# EAGLE design WiFiShield (EAGLE 6.3)
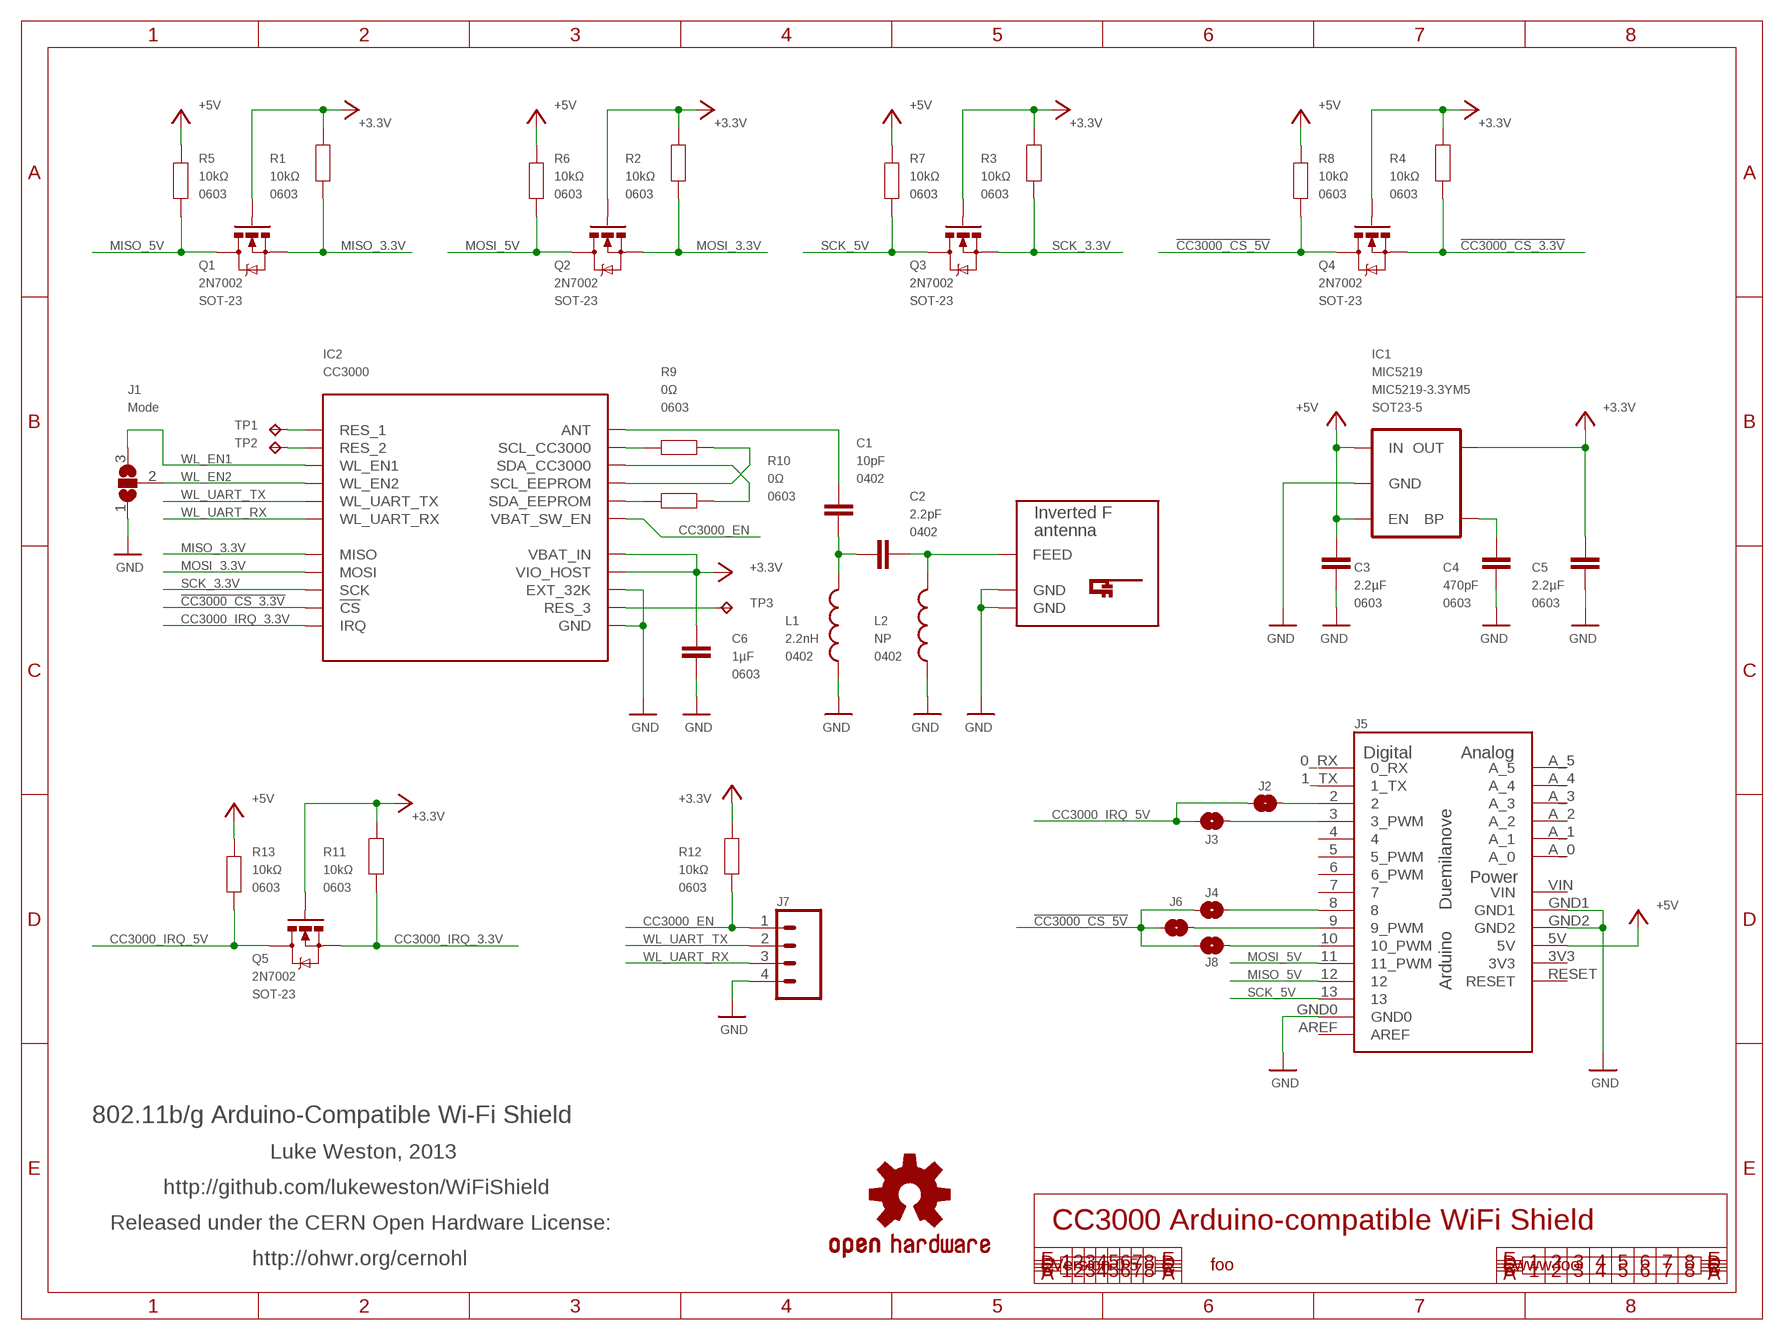
[diagram p0: schematic, sheet 1]

## Parts
A1  INVERTED_F_ANTENNA+2  [DN007+2]
C1  10pF  CAP0402  [C0402]
C2  2.2pF  CAP0402  [C0402]
C3  2.2µF  CAP0603  [0603]
C4  470pF  CAP0603  [0603]
C5  2.2µF  CAP0603  [0603]
C6  1µF  CAP0603  [0603]
IC1  MIC5219  V_REG_LDOSMD  [SOT23-5]
IC2  CC3000  [CC3000]
J1  Mode  SJ2W  [SJ_2]
J2  SJ  [SJ]
J3  SJ  [SJ]
J4  SJ  [SJ]
J5  Arduino-compatible headers  ARDUINO-USBNO-OUTLINE-NO-TEXT-OCTAGONAL  [NO-OUTLINE-OCTAGONAL-NOTEXT]
J6  SJ  [SJ]
J7  M041.27MM  [1X04-1.27MM]
J8  SJ  [SJ]
L1  2.2nH  INDUCTOR0402  [C0402]
L2  NP  INDUCTOR0402  [C0402]
Q1  2N7002  MOSFET-NCHANNELSMD  [SOT23-3]
Q2  2N7002  MOSFET-NCHANNELSMD  [SOT23-3]
Q3  2N7002  MOSFET-NCHANNELSMD  [SOT23-3]
Q4  2N7002  MOSFET-NCHANNELSMD  [SOT23-3]
Q5  2N7002  MOSFET-NCHANNELSMD  [SOT23-3]
R1  10kΩ  RESISTOR0603  [0603]
R2  10kΩ  RESISTOR0603  [0603]
R3  10kΩ  RESISTOR0603  [0603]
R4  10kΩ  RESISTOR0603  [0603]
R5  10kΩ  RESISTOR0603  [0603]
R6  10kΩ  RESISTOR0603  [0603]
R7  10kΩ  RESISTOR0603  [0603]
R8  10kΩ  RESISTOR0603  [0603]
R9  0Ω  RESISTOR0603  [0603]
R10  0Ω  RESISTOR0603  [0603]
R11  10kΩ  RESISTOR0603  [0603]
R12  10kΩ  RESISTOR0603  [0603]
R13  10kΩ  RESISTOR0603  [0603]
SY  OSHW-LOGOS  [OSHW-LOGO-S]
TP1  TPTP06R  [TP06R]
TP2  TPTP06R  [TP06R]
TP3  TPTP06R  [TP06R]

## Nets
!CC3000_CS_3.3V: IC2.12(!CS) Q4.2(S) R4.1
!CC3000_CS_5V: J4.1 J6.1 J8.1 Q4.3(D) R8.1
+3V3: C5.1 C6.2 IC1.5(OUT) IC2.19(VBAT_IN) IC2.23(VIO_HOST) Q1.1(G) Q2.1(G) Q3.1(G) Q4.1(G) Q5.1(G) R1.2 R2.2 R3.2 R4.2 R11.2 R12.2 ; supply symbol labelled +3.3V
+5V: C3.2 IC1.1(IN) IC1.3(EN) J5.5V R5.2 R6.2 R7.2 R8.2 R13.2
CC3000_EN: IC2.26(VBAT_SW_EN) J7.1 R12.1
CC3000_IRQ_3.3V: IC2.14(IRQ) Q5.2(S) R11.1
CC3000_IRQ_5V: J2.1 J3.1 Q5.3(D) R13.1
GND: A1.GND A1.GND@1(GND) C3.1 C4.1 C5.2 C6.1 IC1.2(GND) IC2.1(GND) IC2.9(GND) IC2.10(GND) IC2.11(GND) IC2.16(GND) IC2.18(GND) IC2.20(GND) IC2.21(EXT_32K) IC2.22(GND) IC2.25(GND) IC2.31(GND) IC2.32(GND) IC2.33(GND) IC2.34(GND) IC2.36(GND) IC2.37(GND) IC2.38(GND) IC2.39(GND) IC2.40(GND) IC2.41(GND) IC2.42(GND) IC2.43(GND) IC2.44(GND) IC2.45(GND) IC2.46(GND) J1.1 J5.GND0 J5.GND1 J5.GND2 J7.4 L1.2 L2.2
MISO_3.3V: IC2.13(MISO) Q1.2(S) R1.1
MISO_5V: J5.12 Q1.3(D) R5.1
MOSI_3.3V: IC2.15(MOSI) Q2.2(S) R2.1
MOSI_5V: J5.11(11_PWM) Q2.3(D) R6.1
N$1: IC2.27(SDA_EEPROM) R10.2
N$2: IC2.28(SDA_CC3000) R10.1
N$4: J3.2 J5.3(3_PWM)
N$5: IC2.29(SCL_EEPROM) R9.1
N$6: J2.2 J5.2
N$7: J5.9(9_PWM) J6.2
N$9: J4.2 J5.8
N$11: J5.10(10_PWM) J8.2
N$15: IC2.30(SCL_CC3000) R9.2
N$16: C1.2 IC2.35(ANT)
N$43: C4.2 IC1.4(BP)
N$103: C1.1 C2.2 L1.1
N$104: A1.FEED C2.1 L2.1
RES_1: IC2.2(RES_1) TP1.TP
RES_2: IC2.4(RES_2) TP2.TP
RES_3: IC2.24(RES_3) TP3.TP
SCK_3.3V: IC2.17(SCK) Q3.2(S) R3.1
SCK_5V: J5.13 Q3.3(D) R7.1
WL_EN1: IC2.7(WL_EN1) J1.3
WL_EN2: IC2.5(WL_EN2) J1.2
WL_UART_RX: IC2.8(WL_UART_RX) J7.3
WL_UART_TX: IC2.6(WL_UART_TX) J7.2
Unconnected: J5.0_RX J5.1_TX J5.4 J5.5(5_PWM) J5.6(6_PWM) J5.7 J5.A_0 J5.A_1 J5.A_2 J5.A_3 J5.A_4 J5.A_5 J5.AREF J5.RESET

## Notes on the sheet
- 802.11b/g Arduino-Compatible Wi-Fi Shield
- Luke Weston, 2013
- http://github.com/lukeweston/WiFiShield
- Released under the CERN Open Hardware License: | CC3000 Arduino-compatible WiFi Shield
- http://ohwr.org/cernohl
- Version 0.5 | foo | www.foo

## Power pins joined to a net without a drawn wire
3V3: J5.3V3
VIN: J5.VIN

## Library data of the parts
A1 = antenna:INVERTED_F_ANTENNA: 2.4GHz Inverted F Antenna Based on TI Design Note DN007
C1 C2 = freetronics-master-v1:CAP: Capacitor Standard 0603 ceramic capacitor, and 0.1" leaded capacitor.; PACKAGE: 0402
C3-C6 = freetronics-master-v1:CAP: Capacitor Standard 0603 ceramic capacitor, and 0.1" leaded capacitor.; PACKAGE: 0603
IC1 = SparkFun:V_REG_LDO: Voltage Regulator LDO Standard 150mA LDO voltage regulator in SOT-23 layout. Micrel part MIC5205. BP (by-pass) pin is used to lower output noise with 470pF cap.; ID: MIC5219-3.3YM5; PACKAGE: SOT23-5
IC2 = freetronics-luke:CC3000: Texas Instruments CC3000 802.11b/g Network Processor
J1 = freetronics-master-v1:SJ2W: SMD solder JUMPER
J2-J4 J6 J8 = freetronics-luke:SJ: PCB "solder jumper". Note that there should nothing on the BOM corresponding to this "component".
J5 = Arduino-Various:ARDUINO-USB: The Ardiuno Duemilanove Pinouts layoutet as a Bare Shield. v0.5 Also for Arduino Diecimila. This is designed as a Part and has no Outline in the Dimension Layer. The Outline, when present, is drawed at the tPlace / bPlace Layer. Library by Stephanie Lange, http://www.k-ita.de/~sl/
J7 = freetronics-master-v1:M04: Header 4 Standard 4-pin 0.1" header. Use with straight break away headers (SKU : PRT-00116), right angle break away headers (PRT-00553), swiss pins (PRT-00743), machine pins (PRT-00117), and female headers (PRT-00115). Molex polarized connector foot print use with SKU : PRT-08231 with associated crimp pins and housings.
L1 L2 = freetronics-master-v1:INDUCTOR: Inductors Basic Inductor/Choke - 0603 and 1206. Footprints are not proven and vary greatly between part numbers.; PACKAGE: 0402
Q1-Q5 = freetronics-master-v1.1:MOSFET-NCHANNEL; PACKAGE: SOT-23
R1-R13 = freetronics-master-v1:RESISTOR: Resistor Basic schematic elements and footprints for 0603, 1206, and PTH 1/10th watt (small) resistors.; PACKAGE: 0603
SY = SparkFun:OSHW-LOGO: Open Source Hardware Logo This logo indicates the piece of hardware it is found on incorporates a OSHW license and/or adheres to the definition of open source hardware found here: http://freedomdefined.org/OSHW
TP1-TP3 = testpad:TP: Test pad

## Net classes
1 POWER: width 0.305 mm

## Board
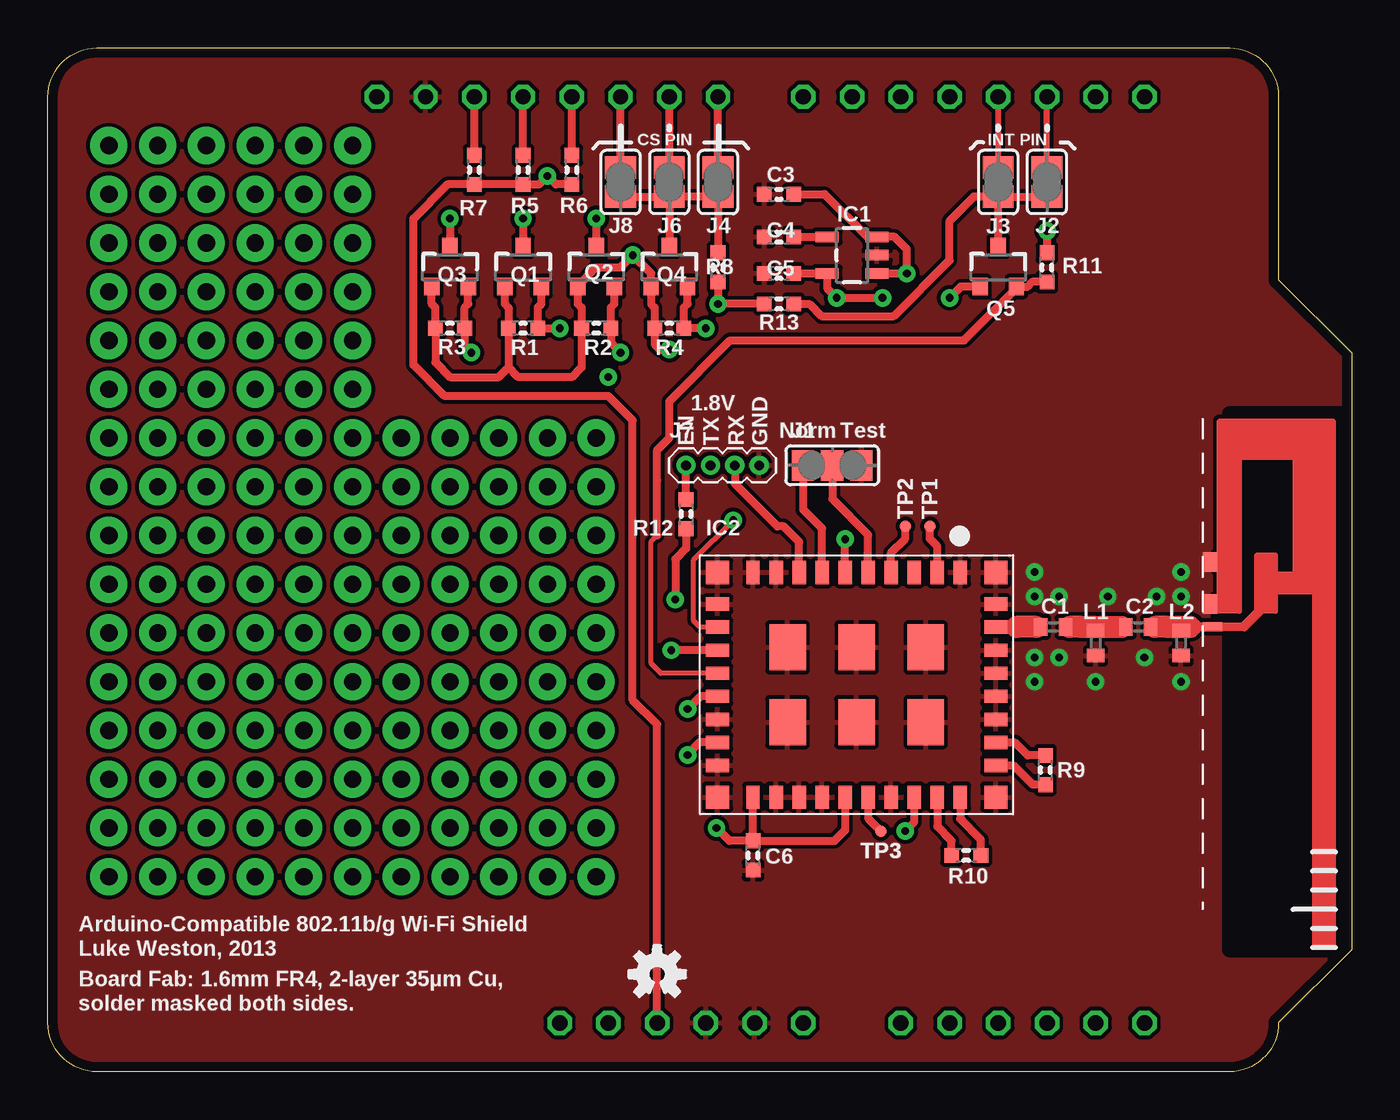
[diagram p1: board, top side]
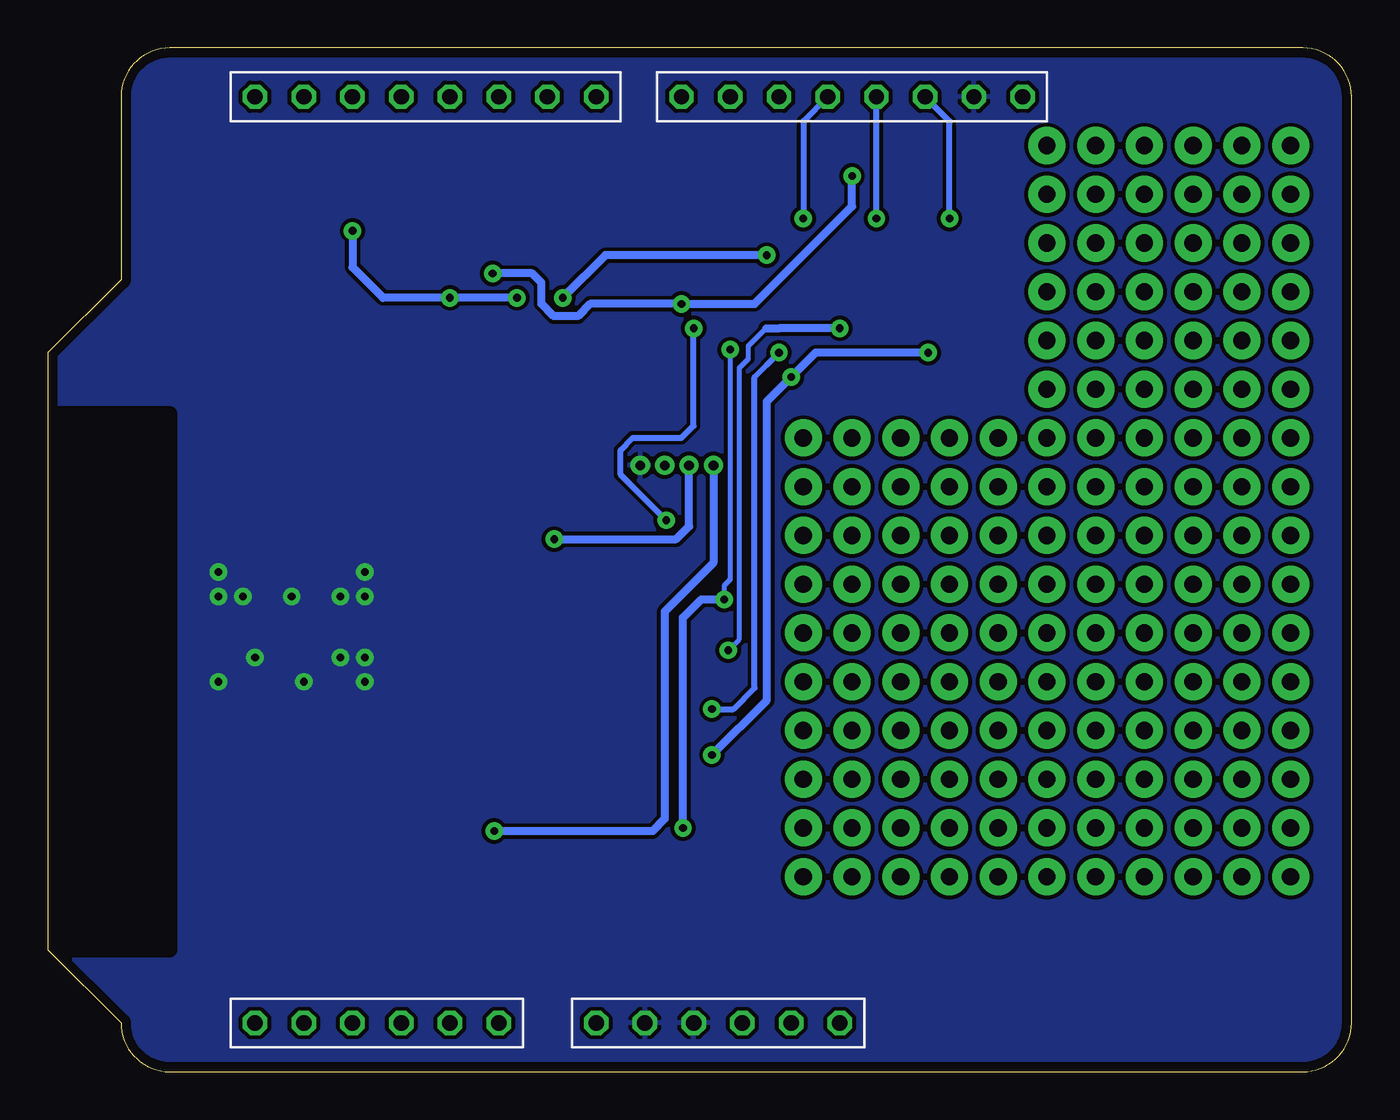
[diagram p2: board, bottom side, seen from below]

Size 67.94 x 53.34 mm. Coordinates in mm from the lower left corner, seen from the top.
Outline: 2.54,53.34 61.59,53.34 arc-90 64.14,50.8 64.14,41.27 67.94,37.47 67.94,6.35 64.14,2.54 arc-90 61.59,0 2.54,0 arc-90 0,2.54 0,50.8 arc-90 2.54,53.34
Copper layers (1*16): Top 0.035mm / dielectric 1.5mm / Bottom 0.035mm
Design rules "PCBCart-Standard *": minimum track width 8mil, minimum drill 0.4mm, track to track 8mil, track to pad 8mil, pad to pad 8mil, via to via 8mil, smd to smd 8mil, copper to edge 20mil, drill to drill 8mil, minimum pad ring 8mil, minimum via ring 10mil, stop-mask expansion 3mil, vias tented up to drill 16mil, thermal gap 8mil
tRestrict: area 61.6,6.3 to 67.3,34.3
bRestrict: area 61.6,6.3 to 67.3,34.3

### Footprints (pad centres in the part's own frame; a part is rotated, then mirrored left to right if it is on the bottom)
DN007+2 = smd 0.46 x 1: FEED 2.22,-2.8 | smd 1.01 x 0.74: GND -1.16,-2.93; GND@1 1.035,-2.93
C0402 = smd 0.7 x 0.9: 1 -0.65,0; 2 0.65,0
0603 = smd 0.762 x 0.762: 1 -0.762,0; 2 0.762,0
SOT23-5 = smd 0.55 x 1.2: 1 -0.95,-1.3; 2 0,-1.3; 3 0.95,-1.3; 4 0.95,1.3; 5 -0.95,1.3
CC3000 = smd 1.2 x 0.7: 1 -5.85,5.4; 2 -5.85,4.2; 3 -5.85,3; 4 -5.85,1.8; 5 -5.85,0.6; 6 -5.85,-0.6; 7 -5.85,-1.8; 8 -5.85,-3; 9 -5.85,-4.2; 10 -5.85,-5.4; 19 5.85,-5.4; 20 5.85,-4.2; 21 5.85,-3; 22 5.85,-1.8; 23 5.85,-0.6; 24 5.85,0.6; 25 5.85,1.8; 26 5.85,3; 27 5.85,4.2; 28 5.85,5.4 | smd 0.7 x 1.2: 11 -4.2,-7.25; 12 -3,-7.25; 13 -1.8,-7.25; 14 -0.6,-7.25; 15 0.6,-7.25; 16 1.8,-7.25; 17 3,-7.25; 18 4.2,-7.25; 29 4.2,7.25; 30 3,7.25; 31 1.8,7.25; 32 0.6,7.25; 33 -0.6,7.25; 34 -1.8,7.25; 35 -3,7.25; 36 -4.2,7.25 | smd 2.4 x 1.9: 37 -1.95,3.6; 38 -1.95,0; 39 -1.95,-3.6; 40 1.95,3.6; 41 1.95,0; 42 1.95,-3.6 | smd 1.2 x 1.2: 43 -5.85,7.25; 44 -5.85,-7.25; 45 5.85,-7.25; 46 5.85,7.25
SJ_2 = smd 1.168 x 1.6: 1 -1.524,0; 2 0,0; 3 1.524,0
SJ = smd 1.168 x 1.6: 1 -0.762,0; 2 0.762,0
NO-OUTLINE-OCTAGONAL-NOTEXT = drill 0.8 pad 1.27 octagon: 0_RX -25.4,27.94; 1_TX -25.4,25.4; 2 -25.4,22.86; 3 -25.4,20.32; 3V3 22.86,0; 4 -25.4,17.78; 5 -25.4,15.24; 5V 22.86,2.54; 6 -25.4,12.7; 7 -25.4,10.16; 8 -25.4,5.715; 9 -25.4,3.175; 10 -25.4,0.635; 11 -25.4,-1.905; 12 -25.4,-4.445; 13 -25.4,-6.985; A_0 22.86,15.24; A_1 22.86,17.78; A_2 22.86,20.32; A_3 22.86,22.86; A_4 22.86,25.4; A_5 22.86,27.94; AREF -25.4,-12.065; GND0 -25.4,-9.525; GND1 22.86,7.62; GND2 22.86,5.08; RESET 22.86,-2.54; VIN 22.86,10.16
1X04-1.27MM = drill 0.508 pad 1: 1 0,0; 2 1.27,0; 3 2.54,0; 4 3.81,0
SOT23-3 = smd 0.8 x 0.9: 1 -0.95,-1; 2 0.95,-1; 3 0,1.1
TP06R = smd 0.6 x 0.6: TP 0,0

### Placement (x,y rotation side)
A1  63.5,25.4 270 top
C1  52.39,23.18 180 top
C2  56.83,23.18 180 top
C3  38.1,45.72 0 top
C4  38.1,43.5 0 top
C5  38.1,41.59 180 top
C6  36.75,11.27 90 top
IC1  41.91,42.55 90 top
IC2  42.15,20.16 270 top
J1  40.88,31.59 180 top
J2  52.07,46.35 90 top
J3  49.53,46.35 90 top
J4  34.92,46.35 90 top
J5  29.21,25.4 270 top
J6  32.38,46.35 90 top
J7  33.26,31.59 0 top
J8  29.84,46.35 90 top
L1  54.61,22.33 270 top
L2  59.05,22.33 270 top
Q1  24.77,41.91 0 top
Q2  28.57,41.91 0 top
Q3  20.95,41.91 0 top
Q4  32.38,41.91 0 top
Q5  49.53,41.91 0 top
R1  24.77,38.73 180 top
R2  28.57,38.73 180 top
R3  20.95,38.73 180 top
R4  32.38,38.73 180 top
R5  24.77,46.99 270 top
R6  27.3,46.99 270 top
R7  22.22,46.99 270 top
R8  34.92,41.91 270 top
R9  51.99,15.72 90 top
R10  47.86,11.27 180 top
R11  52.07,41.91 90 top
R12  33.26,29.05 270 top
R13  38.1,40.01 180 top
SY  31.75,5.08 0 top
TP1  45.96,28.42 90 top
TP2  44.69,28.42 90 top
TP3  43.42,12.54 90 top

### Tracks (layer width: path | path; a pad name or v marks a point on that pad's centre or on a via)
!CC3000_CS_3.3V  (via drill 0.4)
  Top 0.254: IC2.12 33.99,23.16 33.66,23.5 33.66,26.67 v35.72,28.73
  Top 0.406: Q4.2 33.34,40.01 33.15,39.81 R4.1 v34.29,38.73
  Bottom 0.305: v35.72,28.73 38.1,31.11 38.1,32.38 37.46,33.02 34.92,33.02 34.29,33.66 v34.29,38.73
!CC3000_CS_5V
  Top 0.406: J6.1 Q4.3 | J8.1 J6.1 | J6.1 J4.1 R8.1
+3V3  (via drill 0.4)
  Top 0.406: Q3.1 20,40.01 20.19,39.81 R3.2 20.19,36.96 20.95,36.2 23.49,36.2 24,36.7 | Q1.1 23.81,40.01 24,39.81 R1.2 24,36.7 | 24,36.7 24.51,36.2 27.3,36.2 27.81,36.7 R2.2 27.81,39.81 27.62,40.01 Q2.1 27.62,40.96 28.57,41.91 29.84,41.91 v30.48,42.55 31.44,41.59 Q4.1 31.43,40.01 31.62,39.81 R4.2 31.62,37.91 31.91,37.62 v32.38,37.62 | Q5.1 47.58,40.91 v46.99,40.32 | v52.07,43.81 R11.2 | C5.1 IC1.5 40.61,40.83 v41.12,40.32 v43.5,40.32 | C6.2 IC2.19 | C6.2 41,12.03 41.55,12.58 IC2.23 | C6.2 35.51,12.03 v34.85,12.7 | R12.2 33.26,27.27 32.7,26.71 v32.7,24.61
  Bottom 0.254: v32.38,37.62 32.38,25.64 32.7,25.32 v32.7,24.61
  Bottom 0.406: v52.07,43.81 52.07,41.91 50.48,40.32 v46.99,40.32 v43.5,40.32 | v34.85,12.7 34.85,23.65 33.89,24.61 v32.7,24.61 | v30.48,42.55 38.89,42.55 v41.12,40.32
+5V  (via drill 0.4)
  Top 0.406: R8.2 v34.92,40.01 R13.2 | R6.2 26.48,46.23 v26.04,46.67 25.59,46.23 R5.2 R7.2 20.83,46.23 19.05,44.45 19.05,36.83 20.68,35.2 29.21,35.2 30.48,33.93 30.48,19.37 31.75,18.1 J5.5V | IC1.1 v44.77,41.59 | v44.77,41.59 | v44.77,41.59 44.77,42.87 44.13,43.5 IC1.3 42.7,43.5 40.48,45.72 C3.2
  Bottom 0.406: v26.04,46.67 26.04,45.09 31.12,40.01 v34.92,40.01 39.69,40.01 40.32,39.37 41.59,39.37 42.23,40.01 42.23,41.12 42.7,41.59 v44.77,41.59
CC3000_EN  (via drill 0.4)
  Top 0.406: IC2.26 45.15,13 v44.69,12.54 | R12.1 J7.1
  Bottom 0.406: J7.1 33.26,26.51 35.8,23.97 35.8,13.18 36.43,12.54 v44.69,12.54
CC3000_IRQ_3.3V
  Top 0.203: Q5.2 50.44,40.8
  Top 0.254: 31.75,27.94 31.43,27.62 31.43,21.27 31.94,20.76 IC2.14
  Top 0.406: Q5.2 51.07,40.91 51.31,41.15 R11.1 | 31.75,27.94 31.75,30.8 31.75,32.38 32.38,33.02 32.38,34.92 35.56,38.1 47.74,38.1 50.44,40.8
CC3000_IRQ_5V
  Top 0.406: J3.1 J2.1 | Q5.3 J3.1 | J3.1 48.26,45.59 46.99,44.32 46.99,42.27 44.09,39.37 40.32,39.37 39.69,40.01 R13.1
GND  (via drill 0.4)
  other vias: 51.44,26.04 51.44,24.77 52.7,24.77 52.7,21.59 51.44,21.59 51.44,20.32 54.61,20.32 57.15,21.59 55.24,24.77 57.78,24.77 59.05,24.77 59.05,26.04 59.05,20.32
  pour Bottom (isolate 0.203): -0.64,53.98 68.58,53.98 68.58,-0.64 -0.64,-0.64
  pour Top (isolate 0.203): -0.64,53.98 68.58,53.98 68.58,-0.64 -0.64,-0.64
MISO_3.3V  (via drill 0.4)
  Top 0.406: Q1.2 25.72,40.01 25.53,39.81 R1.1 v26.67,38.73 | IC2.13 v32.49,21.96
  Bottom 0.254: v32.49,21.96 31.91,22.54 31.91,36.67 31.43,37.15 31.43,37.82 30.52,38.73
  Bottom 0.406: v26.67,38.73 29.84,38.73 30.52,38.73
MISO_5V  (via drill 0.4)
  Top 0.406: v24.77,44.45 Q1.3 | R5.1 J5.12
  Bottom 0.305: v24.77,44.45 J5.12
MOSI_3.3V  (via drill 0.4)
  Top 0.406: Q2.2 29.53,40.01 29.34,39.81 R2.1 29.34,37.97 v29.84,37.47 | IC2.15 34.01,19.56 v33.34,18.89
  Bottom 0.254: 30.48,36.83 31.12,36.2
  Bottom 0.305: v33.34,18.89 32.23,18.89 31.12,20 31.12,36.2 | 30.48,36.83 v29.84,37.47
MOSI_5V  (via drill 0.4)
  Top 0.406: v28.57,44.45 Q2.3 | R6.1 J5.11
  Bottom 0.305: v28.57,44.45 28.57,49.53 J5.11
N$1
  Top 0.406: R10.2 47.1,12.03 46.35,12.79 IC2.27
N$2
  Top 0.406: R10.1 48.62,12.1 47.55,13.17 IC2.28
N$3  (via drill 0.9 pad 1.93)
  other vias: 3.17,48.26
N$4
  Top 0.305: J3.2 J5.3
N$5
  Top 0.406: IC2.29 50.32,15.96 51.32,14.95 R9.1
N$6
  Top 0.305: J2.2 J5.2
N$7
  Top 0.406: J6.2 J5.9
N$8  (via drill 0.9 pad 1.93)
  other vias: 3.17,45.72
N$9
  Top 0.305: 34.92,46.99 J4.2
  Top 0.406: J4.2 J5.8
N$10  (via drill 0.9 pad 1.93)
  other vias: 13.34,48.26
N$11
  Top 0.305: 29.84,46.99 J8.2
  Top 0.406: J8.2 J5.10
N$12  (via drill 0.9 pad 1.93)
  other vias: 15.88,35.56
N$14  (via drill 0.9 pad 1.93)
  other vias: 15.88,38.1
N$15
  Top 0.406: IC2.30 50.39,17.16 51.07,16.48 R9.2
N$16
  Top 0.66: 51.72,23.16 C1.2
  Top 0.711: IC2.35 51.72,23.16
N$17  (via drill 0.9 pad 1.93)
  other vias: 15.88,40.64
N$18  (via drill 0.9 pad 1.93)
  other vias: 13.34,45.72
N$19  (via drill 0.9 pad 1.93)
  other vias: 10.79,45.72
N$20  (via drill 0.9 pad 1.93)
  other vias: 10.79,48.26
N$21  (via drill 0.9 pad 1.93)
  other vias: 8.26,48.26
N$22  (via drill 0.9 pad 1.93)
  other vias: 5.71,48.26
N$23  (via drill 0.9 pad 1.93)
  other vias: 5.71,45.72
N$24  (via drill 0.9 pad 1.93)
  other vias: 8.26,45.72
N$25  (via drill 0.9 pad 1.93)
  other vias: 15.88,43.18
N$26  (via drill 0.9 pad 1.93)
  other vias: 15.88,45.72
N$27  (via drill 0.9 pad 1.93)
  other vias: 15.88,48.26
N$31  (via drill 0.9 pad 1.93)
  other vias: 20.95,33.02
N$32  (via drill 0.9 pad 1.93)
  other vias: 23.49,33.02
N$33  (via drill 0.9 pad 1.93)
  other vias: 26.04,33.02
N$34  (via drill 0.9 pad 1.93)
  other vias: 18.41,33.02
N$36  (via drill 0.9 pad 1.93)
  other vias: 20.95,10.16
N$37  (via drill 0.9 pad 1.93)
  other vias: 26.04,10.16
N$38  (via drill 0.9 pad 1.93)
  other vias: 23.49,10.16
N$39  (via drill 0.9 pad 1.93)
  other vias: 28.57,10.16
N$40
  Top 1.143: 51.51,23.18 50.48,23.18
N$43
  Top 0.406: C4.2 IC1.4
N$51  (via drill 0.9 pad 1.93)
  other vias: 3.17,43.18
N$52  (via drill 0.9 pad 1.93)
  other vias: 3.17,40.64
N$53  (via drill 0.9 pad 1.93)
  other vias: 3.17,38.1
N$54  (via drill 0.9 pad 1.93)
  other vias: 3.17,35.56
N$55  (via drill 0.9 pad 1.93)
  other vias: 3.17,33.02
N$56  (via drill 0.9 pad 1.93)
  other vias: 3.17,30.48
N$57  (via drill 0.9 pad 1.93)
  other vias: 3.17,27.94
N$58  (via drill 0.9 pad 1.93)
  other vias: 3.17,25.4
N$59  (via drill 0.9 pad 1.93)
  other vias: 3.17,22.86
N$60  (via drill 0.9 pad 1.93)
  other vias: 3.17,20.32
N$61  (via drill 0.9 pad 1.93)
  other vias: 3.17,17.78
N$62  (via drill 0.9 pad 1.93)
  other vias: 3.17,15.24
N$63  (via drill 0.9 pad 1.93)
  other vias: 3.17,12.7
N$64  (via drill 0.9 pad 1.93)
  other vias: 3.17,10.16
N$65  (via drill 0.9 pad 1.93)
  other vias: 5.71,10.16
N$66  (via drill 0.9 pad 1.93)
  other vias: 8.26,10.16
N$67  (via drill 0.9 pad 1.93)
  other vias: 10.79,10.16
N$68  (via drill 0.9 pad 1.93)
  other vias: 13.34,10.16
N$69  (via drill 0.9 pad 1.93)
  other vias: 15.88,10.16
N$70  (via drill 0.9 pad 1.93)
  other vias: 18.41,10.16
N$71  (via drill 0.9 pad 1.93)
  other vias: 28.57,33.02
N$79  (via drill 0.9 pad 1.93)
  other vias: 13.34,40.64
N$80  (via drill 0.9 pad 1.93)
  other vias: 13.34,38.1
N$83  (via drill 0.9 pad 1.93)
  other vias: 15.88,33.02
N$84  (via drill 0.9 pad 1.93)
  other vias: 13.34,33.02
N$85  (via drill 0.9 pad 1.93)
  other vias: 13.34,43.18
N$86  (via drill 0.9 pad 1.93)
  other vias: 13.34,35.56
N$91  (via drill 0.9 pad 1.93)
  other vias: 5.71,43.18
N$92  (via drill 0.9 pad 1.93)
  other vias: 8.26,43.18
N$93  (via drill 0.9 pad 1.93)
  other vias: 10.79,43.18
N$94  (via drill 0.9 pad 1.93)
  other vias: 10.79,40.64
N$95  (via drill 0.9 pad 1.93)
  other vias: 8.26,40.64
N$96  (via drill 0.9 pad 1.93)
  other vias: 5.71,40.64
N$97  (via drill 0.9 pad 1.93)
  other vias: 5.71,33.02
N$98  (via drill 0.9 pad 1.93)
  other vias: 5.71,35.56
N$99  (via drill 0.9 pad 1.93)
  other vias: 5.71,38.1
N$100  (via drill 0.9 pad 1.93)
  other vias: 8.26,38.1
N$101  (via drill 0.9 pad 1.93)
  other vias: 10.79,38.1
N$102  (via drill 0.9 pad 1.93)
  other vias: 10.79,35.56
N$103
  Top 0.406: C1.1 53.26,23.18 | 53.86,23.18 54.61,23.18 L1.1 54.61,23.18 55.96,23.18 C2.2
  Top 1.143: 53.26,23.18 53.86,23.18 55.96,23.18
N$104
  Top 0.305: 58.22,23.26 59.53,23.18 | 59.05,23.18 59.55,23.18
  Top 0.406: C2.1 57.71,23.18 | 58.34,23.18 59.05,23.18 L2.1
  Top 0.47: 59.55,23.18 A1.FEED
  Top 1.143: 57.71,23.18 58.34,23.18 59.05,23.18 59.53,23.18
N$105  (via drill 0.9 pad 1.93)
  other vias: 8.26,35.56
N$106  (via drill 0.9 pad 1.93)
  other vias: 8.26,33.02
N$107  (via drill 0.9 pad 1.93)
  other vias: 10.79,33.02
N$108  (via drill 0.9 pad 1.93)
  other vias: 10.79,30.48
N$109  (via drill 0.9 pad 1.93)
  other vias: 8.26,30.48
N$110  (via drill 0.9 pad 1.93)
  other vias: 5.71,30.48
N$111  (via drill 0.9 pad 1.93)
  other vias: 5.71,27.94
N$112  (via drill 0.9 pad 1.93)
  other vias: 8.26,25.4
N$113  (via drill 0.9 pad 1.93)
  other vias: 10.79,25.4
N$114  (via drill 0.9 pad 1.93)
  other vias: 15.88,25.4
N$115  (via drill 0.9 pad 1.93)
  other vias: 13.34,25.4
N$116  (via drill 0.9 pad 1.93)
  other vias: 13.34,27.94
N$117  (via drill 0.9 pad 1.93)
  other vias: 15.88,27.94
N$118  (via drill 0.9 pad 1.93)
  other vias: 18.41,27.94
N$119  (via drill 0.9 pad 1.93)
  other vias: 20.95,27.94
N$120  (via drill 0.9 pad 1.93)
  other vias: 23.49,27.94
N$121  (via drill 0.9 pad 1.93)
  other vias: 26.04,27.94
N$122  (via drill 0.9 pad 1.93)
  other vias: 28.57,27.94
N$138  (via drill 0.9 pad 1.93)
  other vias: 28.57,12.7
N$139  (via drill 0.9 pad 1.93)
  other vias: 26.04,12.7
N$140  (via drill 0.9 pad 1.93)
  other vias: 23.49,12.7
N$141  (via drill 0.9 pad 1.93)
  other vias: 20.95,12.7
N$142  (via drill 0.9 pad 1.93)
  other vias: 26.04,30.48
N$143  (via drill 0.9 pad 1.93)
  other vias: 28.57,30.48
N$152  (via drill 0.9 pad 1.93)
  other vias: 28.57,17.78
N$153  (via drill 0.9 pad 1.93)
  other vias: 28.57,20.32
N$154  (via drill 0.9 pad 1.93)
  other vias: 28.57,22.86
N$155  (via drill 0.9 pad 1.93)
  other vias: 28.57,25.4
N$157  (via drill 0.9 pad 1.93)
  other vias: 26.04,22.86
N$158  (via drill 0.9 pad 1.93)
  other vias: 26.04,25.4
N$159  (via drill 0.9 pad 1.93)
  other vias: 23.49,25.4
N$160  (via drill 0.9 pad 1.93)
  other vias: 20.95,25.4
N$161  (via drill 0.9 pad 1.93)
  other vias: 18.41,25.4
N$162  (via drill 0.9 pad 1.93)
  other vias: 15.88,30.48
N$163  (via drill 0.9 pad 1.93)
  other vias: 13.34,30.48
N$164  (via drill 0.9 pad 1.93)
  other vias: 18.41,30.48
N$165  (via drill 0.9 pad 1.93)
  other vias: 20.95,30.48
N$166  (via drill 0.9 pad 1.93)
  other vias: 23.49,30.48
N$167  (via drill 0.9 pad 1.93)
  other vias: 5.71,25.4
N$168  (via drill 0.9 pad 1.93)
  other vias: 5.71,20.32
N$169  (via drill 0.9 pad 1.93)
  other vias: 8.26,22.86
N$170  (via drill 0.9 pad 1.93)
  other vias: 5.71,22.86
N$171  (via drill 0.9 pad 1.93)
  other vias: 8.26,27.94
N$172  (via drill 0.9 pad 1.93)
  other vias: 10.79,27.94
N$173  (via drill 0.9 pad 1.93)
  other vias: 18.41,12.7
N$174  (via drill 0.9 pad 1.93)
  other vias: 15.88,12.7
N$175  (via drill 0.9 pad 1.93)
  other vias: 13.34,12.7
N$176  (via drill 0.9 pad 1.93)
  other vias: 10.79,12.7
N$177  (via drill 0.9 pad 1.93)
  other vias: 8.26,12.7
N$178  (via drill 0.9 pad 1.93)
  other vias: 5.71,12.7
N$179  (via drill 0.9 pad 1.93)
  other vias: 5.71,15.24
N$180  (via drill 0.9 pad 1.93)
  other vias: 5.71,17.78
N$181  (via drill 0.9 pad 1.93)
  other vias: 8.26,17.78
N$182  (via drill 0.9 pad 1.93)
  other vias: 8.26,20.32
N$183  (via drill 0.9 pad 1.93)
  other vias: 10.79,20.32
N$184  (via drill 0.9 pad 1.93)
  other vias: 13.34,22.86
N$185  (via drill 0.9 pad 1.93)
  other vias: 10.79,22.86
N$186  (via drill 0.9 pad 1.93)
  other vias: 13.34,20.32
N$187  (via drill 0.9 pad 1.93)
  other vias: 15.88,17.78
N$188  (via drill 0.9 pad 1.93)
  other vias: 15.88,22.86
N$189  (via drill 0.9 pad 1.93)
  other vias: 15.88,20.32
N$190  (via drill 0.9 pad 1.93)
  other vias: 18.41,20.32
N$191  (via drill 0.9 pad 1.93)
  other vias: 18.41,22.86
N$192  (via drill 0.9 pad 1.93)
  other vias: 18.41,15.24
N$193  (via drill 0.9 pad 1.93)
  other vias: 15.88,15.24
N$194  (via drill 0.9 pad 1.93)
  other vias: 13.34,15.24
N$195  (via drill 0.9 pad 1.93)
  other vias: 13.34,17.78
N$196  (via drill 0.9 pad 1.93)
  other vias: 10.79,17.78
N$197  (via drill 0.9 pad 1.93)
  other vias: 10.79,15.24
N$198  (via drill 0.9 pad 1.93)
  other vias: 8.26,15.24
N$199  (via drill 0.9 pad 1.93)
  other vias: 20.95,15.24
N$200  (via drill 0.9 pad 1.93)
  other vias: 18.41,17.78
N$201  (via drill 0.9 pad 1.93)
  other vias: 20.95,17.78
N$202  (via drill 0.9 pad 1.93)
  other vias: 20.95,20.32
N$203  (via drill 0.9 pad 1.93)
  other vias: 20.95,22.86
N$204  (via drill 0.9 pad 1.93)
  other vias: 23.49,20.32
N$205  (via drill 0.9 pad 1.93)
  other vias: 23.49,22.86
N$206  (via drill 0.9 pad 1.93)
  other vias: 23.49,17.78
N$207  (via drill 0.9 pad 1.93)
  other vias: 26.04,15.24
N$208  (via drill 0.9 pad 1.93)
  other vias: 26.04,17.78
N$209  (via drill 0.9 pad 1.93)
  other vias: 23.49,15.24
N$210  (via drill 0.9 pad 1.93)
  other vias: 26.04,20.32
N$211  (via drill 0.9 pad 1.93)
  other vias: 28.57,15.24
RES_1
  Top 0.406: IC2.2 46.35,27.39 45.96,27.78 TP1.TP
RES_2
  Top 0.406: IC2.4 43.95,27.04 44.69,27.78 TP2.TP
RES_3
  Top 0.406: IC2.24 42.75,13.21 TP3.TP
SCK_3.3V  (via drill 0.4)
  Top 0.406: Q3.2 21.91,40.01 21.72,39.81 R3.1 21.72,37.81 v22.07,37.47 | IC2.17 33.96,17.16 v33.34,16.51
  Bottom 0.406: v22.07,37.47 27.94,37.47 v29.21,36.2 30.48,34.92 30.48,34.13 30.48,19.37 v33.34,16.51
SCK_5V  (via drill 0.4)
  Top 0.406: v20.95,44.45 Q3.3 | R7.1 J5.13
  Bottom 0.305: v20.95,44.45 20.95,49.53 J5.13
WL_EN1
  Top 0.406: IC2.7 40.35,28.31 39.35,29.3 J1.3
WL_EN2
  Top 0.406: IC2.5 42.75,27.98 40.88,29.84 J1.2
WL_UART_RX
  Top 0.406: IC2.8 39.15,27.61 38.34,28.42 38.02,28.42 35.8,30.64 J7.3
WL_UART_TX  (via drill 0.4)
  Top 0.406: IC2.6 v41.55,27.75
  Bottom 0.406: v41.55,27.75 35.2,27.75 34.53,28.42 J7.2

### Text on the board
tPlace: CS PIN | INT PIN | 1.8V | EN | TX | RX | GND | Norm | Test | TP2 | TP1 | TP3 | Arduino-Compatible 802.11b/g Wi-Fi Shield | Luke Weston, 2013 | Board Fab: 1.6mm FR4, 2-layer 35µm Cu, | solder masked both sides.